# Altium schematic sheet SoftRoboticsToolKit.SchDoc
size A4
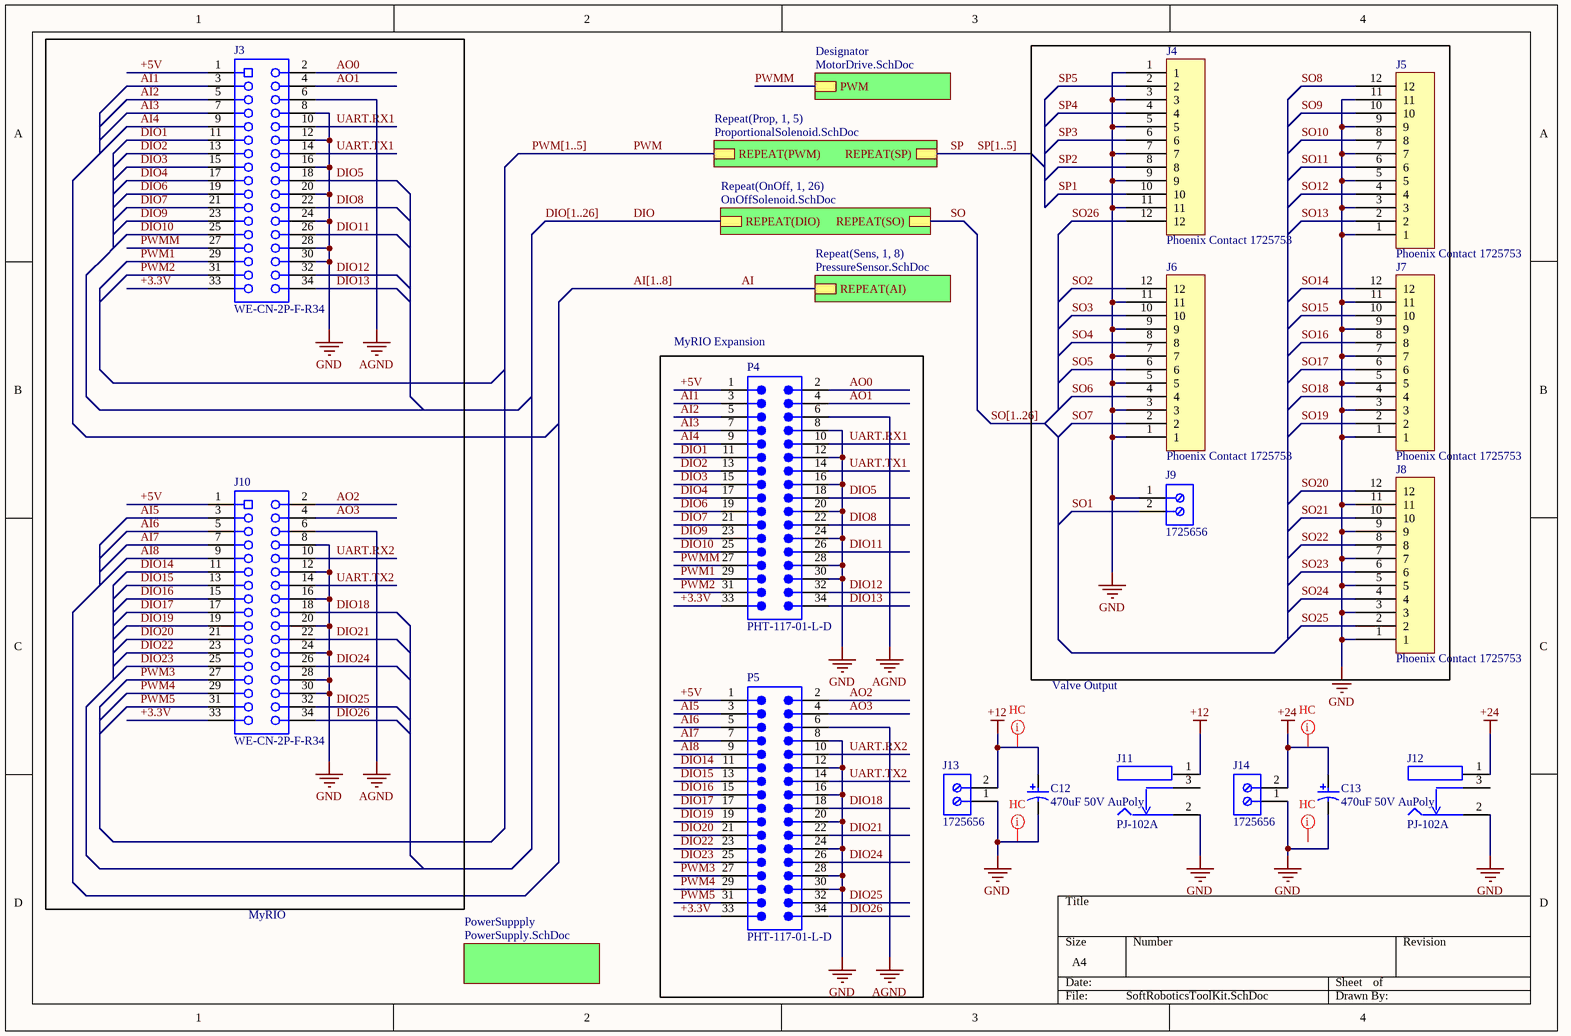
[diagram p0: SoftRoboticsToolKit.SchDoc]

## Parts
C12  470uF 50V AuPoly  [CAPAE137130X163M]
C13  470uF 50V AuPoly  [CAPAE137130X163M]
J3  WE-CN-2P-F-R34  [613034243121]
J4  Phoenix Contact 1725753  [PHOE-1725656-12]
J5  Phoenix Contact 1725753  [PHOE-1725656-12]
J6  Phoenix Contact 1725753  [PHOE-1725656-12]
J7  Phoenix Contact 1725753  [PHOE-1725656-12]
J8  Phoenix Contact 1725753  [PHOE-1725656-12]
J9  1725656  [PHOE-1725656-2]
J10  WE-CN-2P-F-R34  [613034243121]
J11  PJ-102A  [FP-PJ-102A-MFG]
J12  PJ-102A  [FP-PJ-102A-MFG]
J13  1725656  [PHOE-1725656-2]
J14  1725656  [PHOE-1725656-2]
P4  PHT-117-01-L-D  [PHT-117-01-L-D]
P5  PHT-117-01-L-D  [PHT-117-01-L-D]

## Blocks framed on the sheet
MyRIO Expansion: P4 P5

## Sub-sheets
Designator = MotorDrive.SchDoc: PWM
PowerSuppply = PowerSupply.SchDoc: no entries
Repeat(OnOff, 1, 26) = OnOffSolenoid.SchDoc: REPEAT(DIO), REPEAT(SO)
Repeat(Prop, 1, 5) = ProportionalSolenoid.SchDoc: REPEAT(PWM), REPEAT(SP)
Repeat(Sens, 1, 8) = PressureSensor.SchDoc: REPEAT(AI)

## Nets
+12: C12.1 J11.1 J13.2
+24: C13.1 J12.1 J14.2
AGND: J3.6 J10.6 P4.6 P5.6
GND: C12.2 C13.2 J3.8 J3.12 J3.16 J3.20 J3.24 J3.28 J3.30 J4.1 J4.3 J4.5 J4.7 J4.9 J4.11 J5.1 J5.3 J5.5 J5.7 J5.9 J5.11 J6.1 J6.3 J6.5 J6.7 J6.9 J6.11 J7.1 J7.3 J7.5 J7.7 J7.9 J7.11 J8.1 J8.3 J8.5 J8.7 J8.9 J8.11 J9.1 J10.8 J10.12 J10.16 J10.20 J10.24 J10.28 J10.30 J11.2 J12.2 J13.1 J14.1 P4.8 P4.12 P4.16 P4.20 P4.24 P4.28 P4.30 P5.8 P5.12 P5.16 P5.20 P5.24 P5.28 P5.30
+3.3V: J3.33 J10.33 P4.33 P5.33
+5V: J3.1 J10.1 P4.1 P5.1
AI: sheet Repeat(Sens, 1, 8)/REPEAT(AI)
AI1: J3.3 P4.3
AI2: J3.5 P4.5
AI3: J3.7 P4.7
AI4: J3.9 P4.9
AI5: J10.3 P5.3
AI6: J10.5 P5.5
AI7: J10.7 P5.7
AI8: J10.9 P5.9
AO0: J3.2 P4.2
AO1: J3.4 P4.4
AO2: J10.2 P5.2
AO3: J10.4 P5.4
DIO: sheet Repeat(OnOff, 1, 26)/REPEAT(DIO)
DIO1: J3.11 P4.11
DIO2: J3.13 P4.13
DIO3: J3.15 P4.15
DIO4: J3.17 P4.17
DIO5: J3.18 P4.18
DIO6: J3.19 P4.19
DIO7: J3.21 P4.21
DIO8: J3.22 P4.22
DIO9: J3.23 P4.23
DIO10: J3.25 P4.25
DIO11: J3.26 P4.26
DIO12: J3.32 P4.32
DIO13: J3.34 P4.34
DIO14: J10.11 P5.11
DIO15: J10.13 P5.13
DIO16: J10.15 P5.15
DIO17: J10.17 P5.17
DIO18: J10.18 P5.18
DIO19: J10.19 P5.19
DIO20: J10.21 P5.21
DIO21: J10.22 P5.22
DIO22: J10.23 P5.23
DIO23: J10.25 P5.25
DIO24: J10.26 P5.26
DIO25: J10.32 P5.32
DIO26: J10.34 P5.34
PWM: sheet Repeat(Prop, 1, 5)/REPEAT(PWM)
PWM1: J3.29 P4.29
PWM2: J3.31 P4.31
PWM3: J10.27 P5.27
PWM4: J10.29 P5.29
PWM5: J10.31 P5.31
PWMM: J3.27 P4.27 ; sheet Designator/PWM
SO: sheet Repeat(OnOff, 1, 26)/REPEAT(SO)
SO1: J9.2
SO2: J6.12
SO3: J6.10
SO4: J6.8
SO5: J6.6
SO6: J6.4
SO7: J6.2
SO8: J5.12
SO9: J5.10
SO10: J5.8
SO11: J5.6
SO12: J5.4
SO13: J5.2
SO14: J7.12
SO15: J7.10
SO16: J7.8
SO17: J7.6
SO18: J7.4
SO19: J7.2
SO20: J8.12
SO21: J8.10
SO22: J8.8
SO23: J8.6
SO24: J8.4
SO25: J8.2
SO26: J4.12
SP: sheet Repeat(Prop, 1, 5)/REPEAT(SP)
SP1: J4.10
SP2: J4.8
SP3: J4.6
SP4: J4.4
SP5: J4.2
UART.RX1: J3.10 P4.10
UART.RX2: J10.10 P5.10
UART.TX1: J3.14 P4.14
UART.TX2: J10.14 P5.14

Not connected (* = marked no-connect by the designer): J11 3; J12 3

## Buses and harness runs
bus AI[1..8]
bus DIO[1..26]
bus PWM[1..5]
bus SO[1..26]
bus SP[1..5]

## Layout directives
net class HC: (no net found under the mark), +12, +24, GND

## Notes on the sheet
- Valve Output
- MyRIO

## Library data of the parts
C12 C13 = C-Poly: Manufacturer: AVX; DELETED: Compliant; Product Depth (mm): 4.3mm; Product Length (mm): 7.3mm; Case Style: Molded; Product Diameter (mm): NotRequiredmm; DF: 6%; Seal: NotRequired; Capacitance: 22000000pF; Product Height (mm): 2.9mm; Rad Hardened: No; ESR: 0.2ohm; Polarity: Polar; DCL: 5.5uA; Voltage: 25VDC; Tolerance (+ or -): 10%; Construction: SMTChip; Mounting Style: SurfaceMount; Packaging: TapeandReel; Case Code: D; Package Reference: 7343-31; Manufacturer URL: http://www.avx.com/; Failure Rate: NotRequired; Insulation: NotRequired; Operating Temp Range: -55Cto125C; Mounting Technology: SurfaceMount; Package Description: 2-Pin Surface Mount Device, Body 7.3 x 4.35 mm; Length W/Weld (max): NotRequiredmm; Lead Spacing (nom): NotRequiredmm; Seated Plane Height: NotRequiredmm; Wire Form: NotRequired; Datasheet Version: 02/2004; Datasheet URL: https://datasheet.ciiva.com/11793/0900766b80066cb4-11793194.pdf; Length W/Weld: NotRequiredmm; Package / Case: 7343-31
J4-J8 = 1725753
J9 J13 J14 = CMP-2000-05299-1: Male Header, Pitch 2.54 mm, 1 x 2 Position, Height 9 mm, Tail Length 3.5 mm; Manufacturer: Phoenix Contact; Number of contacts: 2; Content: 250pc(s); Pitch: 2.54mm; Industrial packaging: Yes; Colour: Green; Manufacturer part No.: 1725656; Type: MPT0,5/2-2,54; Datasheet URL: http://datasheet.octopart.com/1725656-Phoenix-Contact-datasheet-5302866.pdf; Manufacturer URL: http://www.phoenixcontact.com/; Datasheet Version: Apr-08
J11 J12 = CMP-14830-000006-1: CONN PWR JACK 2X5.5MM SOLDER; Manufacturer: CUI; Conn Gender: Male; Voltage: 24V; Industry Recognized Mating Diameter: 2.10mm ID (0.083"), 5.50mm OD (0.217"); Number Of Contacts: 3; Number of Positions/Contacts: 2 Conductors, 3 Contacts; Current Rating: 2.5A; Conn Orientation: Right Angle; ComponentLink2URL: http://www.cui.com/product/resource/pj-102a.pdf; Manufacturer Part Number: PJ-102A; Contact Material: Tin,Nickel; Digikey Description: CONN PWR JACK 2X5.5MM SOLDER; RoHS: TRUE; Height: 11.2mm; Category: Conn; Octopart: https://octopart.com/pj-102a-cui-286936; Device Class L1: Connectors; Automotive: No; Package: PJ-102A; Device Class L2: Power Connectors; Temperature Range Low: -25°C; Temperature: -25°C to +85°C; Mouser Description: DC Power Connectors Power Jacks; Lead Free: Yes; Device Class L3: unset; Voltage Rating: 24V; ComponentLink2Description: Datasheet; Temperature Range High: +85°C